# Altium schematic sheet PA stage 1.SchDoc
size A; SheetNumber: 8; SheetTotal: 12
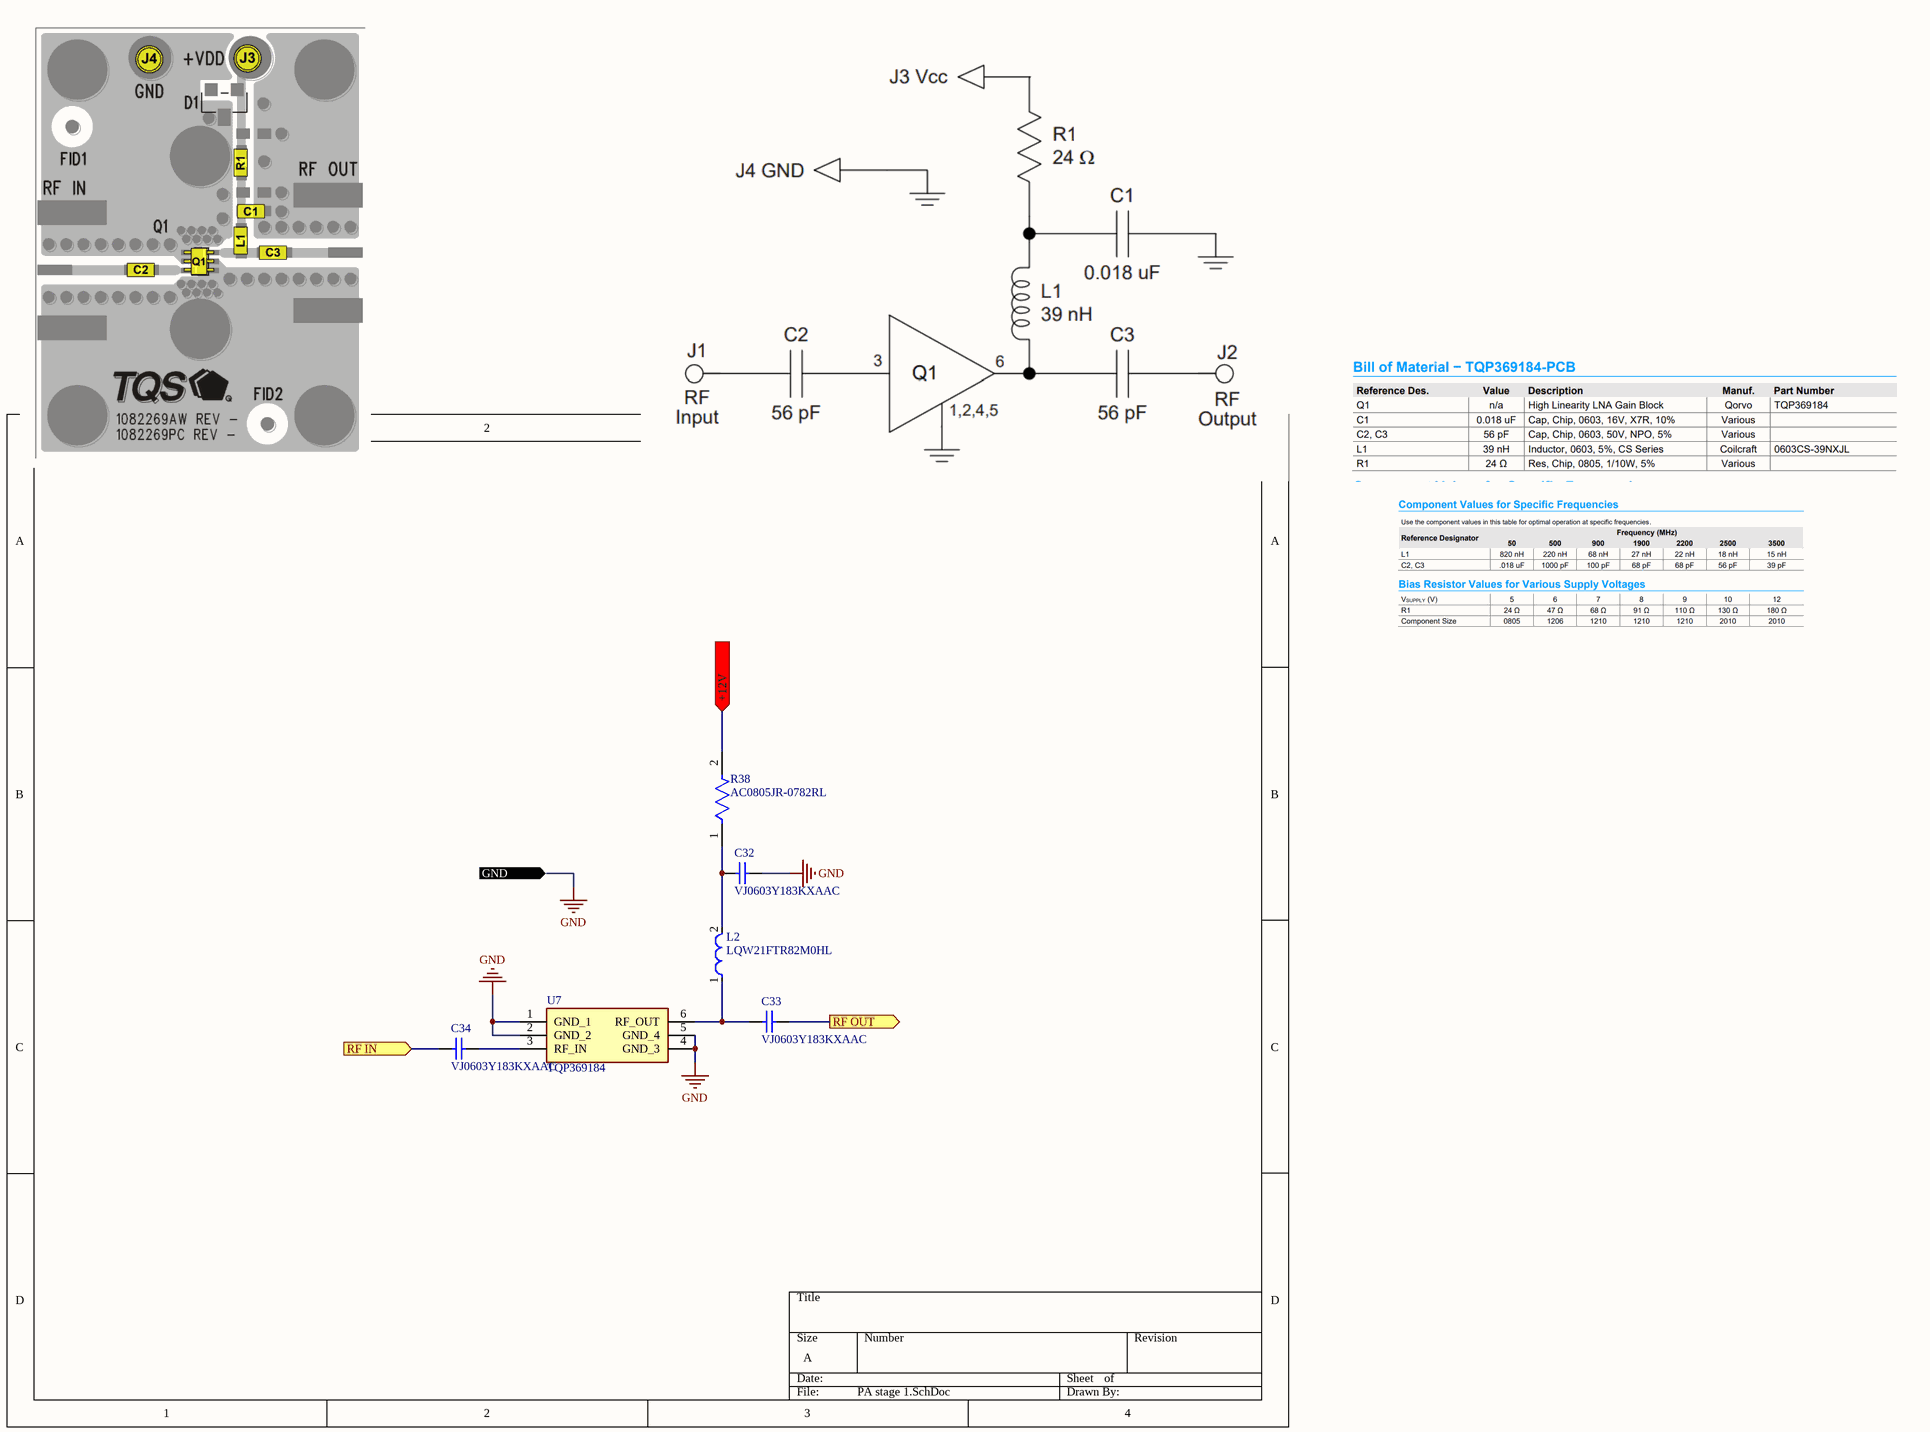
[diagram p0: PA stage 1.SchDoc]

## Parts
C32  VJ0603Y183KXAAC  [CAPC1608X92X38ML15T08]
C33  VJ0603Y183KXAAC  [CAPC1608X92X38ML15T08]
C34  VJ0603Y183KXAAC  [CAPC1608X92X38ML15T08]
L2  LQW21FTR82M0HL  [FP-LQW21FT_0H-MFG]
R38  AC0805JR-0782RL  [FP-AC0805-MFG]
U7  TQP369184  [SOT65P210X110-6N]

## Ports
+12V (in), GND (in), RF IN (in), RF OUT (out)

## Nets
GND: C32.2 U7.1(GND_1) U7.2(GND_2) U7.4(GND_3) U7.5(GND_4) ; port GND
+12V: R38.2 ; port +12V
RF IN: C34.1 ; port RF IN
RF OUT: C33.2 ; port RF OUT
NetC32_1: C32.1 L2.2 R38.1
NetC33_1: C33.1 L2.1 U7.6(RF_OUT)
NetC34_2: C34.2 U7.3(RF_IN)

## Library data of the parts
C32-C34 = CMP-2006-01326-1: Manufacturer: Vitramon; Part Number: VJ0603Y183KXAAC
L2 = CMP-06042-017060-1: FIXED IND 1UH 700MA POWRTRN
R38 = CMP-03412-037249-1: RES SMD 82 OHM 5% 1/8W 0805; Manufacturer: Yageo; Tolerance: 0.05; Value: 82Ω; Automotive Grade: Grade 0; Voltage Rating: 150V; Footprint Url: http://www.yageo.com/exep/pages/download/literatures/PYu-R_Mount_10.pdf; Ipc Land Pattern Name: RESC200125X50; Package: AC0805; Category: Res; Height: 0.6mm; Temperature Range High: +155°C; Digikey Description: RES SMD 82 OHM 5% 1/8W 0805; Device Class L2: Resistors; Power Rating: 1/8W; ComponentLink2URL: http://www.yageo.com/documents/recent/PYu-AC_51_RoHS_L_6.pdf; Mouser Description: Thick Film Resistors - SMD 1/8W 82ohm 5% AEC-Q200; Temperature: -55°C to +155°C; Octopart: https://octopart.com/ac0805jr-0782rl-yageo-71367939; Resistance: 82Ω; Composition: Thick Film; Device Class L3: Chip SMD Resistors; ComponentLink2Description: Datasheet; Device Class L1: Passive Components; Series: AC; Temperature Range Low: -55°C; RoHS: TRUE; Lead Free: Yes; Manufacturer Part Number: AC0805JR-0782RL; Automotive: Yes
U7 = TQP369184: DC  6 GHz Gain Block; Manufacturer_Name: Qorvo; Geometry.Height: 1.1mm; Mouser Part Number: 772-TQP369184; Mouser Price/Stock: https://www.mouser.co.uk/ProductDetail/Qorvo/TQP369184?qs=opBjA1TV900HByuIeJCWsQ%3D%3D; Manufacturer_Part_Number: TQP369184; Datasheet Link: https://www.qorvo.com/products/d/da005471